# Altium schematic sheet DTMF.SchDoc: DTMF
size A4; Organization: ORGANIZATION; Address1: ADDRESS 1; Address2: ADDRESS 2; Address3: ADDRESS 3; Address4: ADDRESS 4; Revision: -; SheetNumber: 8; SheetTotal: 11; ENG_APP_DATE: --/--/--; DSN_APP_DATE: --/--/--; CHK_APP_DATE: --/--/--
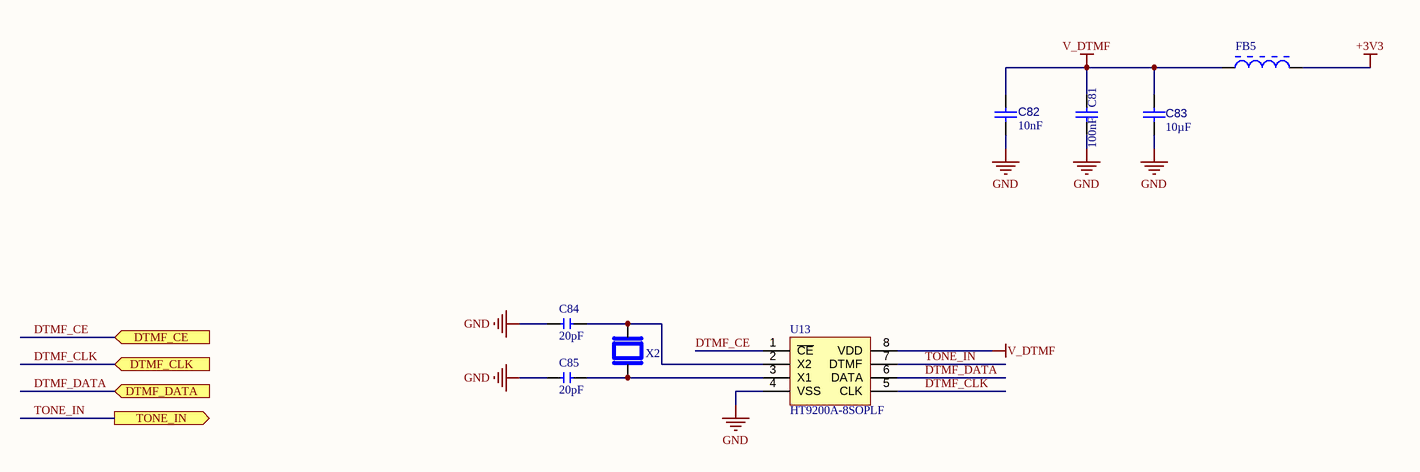
[diagram p0: DTMF.SchDoc]

## Parts
C81  value 100nF  [C0603]  (hidden comment: CC0603KRX7R8BB104)
C82  value 10nF  [C0603]  (hidden comment: 06035C103KAT2A)
C83  value 10µF  [0805]  (hidden comment: C0805C106K9PACTU)
C84  value 20pF  [0805]  (hidden comment: CMP-001-00183-1)
C85  value 20pF  [0805]  (hidden comment: CMP-001-00183-1)
FB5  CMP-006-00051-1  [R0603]  (value not drawn)
U13  HT9200A-8SOPLF  [SSOIC8]
X2  CMP-003-00038-1  [XTAL]  (value not drawn)

## Ports
DTMF_CE (in), DTMF_CLK (in), DTMF_DATA (in), TONE_IN (out)

## Nets
+3V3: FB5.2
GND: C81.2 C82.2 C83.1 C84.1 C85.1 U13.4(VSS)
V_DTMF: C81.1 C82.1 C83.2 FB5.1 U13.8(VDD)
DTMF_CE: U13.1(~{CE}) ; port DTMF_CE
DTMF_CLK: U13.5(CLK) ; port DTMF_CLK
DTMF_DATA: U13.6(DATA) ; port DTMF_DATA
TONE_IN: U13.7(DTMF) ; port TONE_IN
NetC84_2: C84.2 U13.2(X2) X2.2
NetC85_2: C85.2 U13.3(X1) X2.1

## Notes on the sheet
- APPROVALS
- DATE
- PROJECT
- Kish Spark Building
- No. 8, Avesta Street
- ENG:
- DSN:
- CHK:
- PROJECT REVISION:
- DESIGN ITEM:
- DOCUMENT REVISION:
- Tehran, Iran
- Seoul Street, Sheikh Bahaie
- SIZE
- REV
- SCALE:
- CAGE CODE
- A4
- FILE NAME
- TITLE
- SHEET
- OF

## Library data of the parts
C81 = CMP-001-00108-2: YAGEO - CC0603KRX7R8BB104 - CERAMIC CAPACITOR, 0.1UF, 25V, X7R, 10%, 0603, FULL REEL; Case/Package: 0603; Pins: 2; RoHS Compliant: Yes; Min Operating Temperature: -55°C; Max Operating Temperature: 125°C; Voltage Rating: 25V; Tolerance: 10%; Design Item ID: CC0603KRX7R8BB104; Case Code (Metric): 1608; Category: Ceramic Capacitors; Depth: 0.8mm; Dielectric: X7R; Halogen Free: Halogen Free; Height: 0.8mm; Lead Free: Lead Free; Length: 1.6mm; Manufacturer 1: Yageo; Manufacturer Part Number 1: CC0603KRX7R8BB104; Mount: Surface Mount; Package Quantity: 1; Packaging: Tape and Reel; Pricing 1: 1=0.10000, 10=0.05000, 50=0.02720, 100=0.02220, 500=0.01586, 1000=0.01246 (USD); Radiation Hardening: No; REACH SVHC: Unknown; Resistor Type: Ceramic; RoHS: Yes; Series: CC; Source: PTZLib.SchLib; Stock 1: 4053185; Termination: SMD/SMT; Thickness: 0.035inch; Voltage: 25V; Voltage Rating (DC): 25V; Width: 0.8mm; ComponentLink1Description: https://datasheet.ciiva.com/144/mlccorderingcode-144075.pdf?src-supplier=Digi-Key; ComponentLink1URL: https://datasheet.ciiva.com/144/mlccorderingcode-144075.pdf?src-supplier=Digi-Key; ComponentLink2Description: https://datasheet.ciiva.com/11786/0900766b80c10176-11786120.pdf?src-supplier=RSComponents; ComponentLink2URL: https://datasheet.ciiva.com/11786/0900766b80c10176-11786120.pdf?src-supplier=RSComponents; ComponentLink3Description: https://datasheet.ciiva.com/7978/1489800-7978155.pdf?src-supplier=Element14; ComponentLink3URL: https://datasheet.ciiva.com/7978/1489800-7978155.pdf?src-supplier=Element14; ComponentLink4Description: https://datasheet.ciiva.com/28450/1489800-28450584.pdf?src-supplier=Element14; ComponentLink4URL: https://datasheet.ciiva.com/28450/1489800-28450584.pdf?src-supplier=Element14; ComponentLink5Description: https://datasheet.ciiva.com/144/mlccorderingcode-144074.pdf?src-supplier=Digi-Key; ComponentLink5URL: https://datasheet.ciiva.com/144/mlccorderingcode-144074.pdf?src-supplier=Digi-Key; ComponentLink6Description: https://datasheet.ciiva.com/144/mlccorderingcode-144073.pdf?src-supplier=Digi-Key; ComponentLink6URL: https://datasheet.ciiva.com/144/mlccorderingcode-144073.pdf?src-supplier=Digi-Key; ComponentLink7Description: https://datasheet.ciiva.com/13389/upy-gphc-x7r-6-3v-to-50v-8-13389352.pdf?src-supplier=Mouser; ComponentLink7URL: https://datasheet.ciiva.com/13389/upy-gphc-x7r-6-3v-to-50v-8-13389352.pdf?src-supplier=Mouser; ComponentLink8Description: https://datasheet.ciiva.com/11587/upy-gphc-x7r-6-3v-to-50v-8-11587208.pdf?src-supplier=Avnet; ComponentLink8URL: https://datasheet.ciiva.com/11587/upy-gphc-x7r-6-3v-to-50v-8-11587208.pdf?src-supplier=Avnet; ComponentLink9Description: https://datasheet.ciiva.com/26829/getdatasheetpartid-403577-26829431.pdf?src-supplier=Verical; ComponentLink9URL: https://datasheet.ciiva.com/26829/getdatasheetpartid-403577-26829431.pdf?src-supplier=Verical; ComponentLink10Description: https://datasheet.ciiva.com/17434/upy-gphc-x7r-6-3v-to-50v-8-17434263.pdf?src-supplier=Avnet+Europe; ComponentLink10URL: https://datasheet.ciiva.com/17434/upy-gphc-x7r-6-3v-to-50v-8-17434263.pdf?src-supplier=Avnet+Europe
C82 = CMP-001-00096-2: 0603 10nF 50 V ±10 % Tolerance X7R Surface Mount Multilayer Ceramic Capacitor; Manufacturer: Kyocera AVX; Voltage Rating: 50V; Tolerance: 10%; Dissipation Factor: 2.5%; Insulation Resistance: 100GR; Case/Package: 0603; Pins: 2; Min Operating Temperature: -55°C; Max Operating Temperature: 125°C; Design Item ID: 06035C103KAT2A; Case Code (Metric): 1608; Category: Ceramic Capacitors; Contact Plating: Tin,Matte; Depth: 0.81mm; Dielectric: X7R; Dielectric Material: Ceramic; Height: 0.9mm; Lead Free: Lead Free; Length: 1.6mm; Manufacturer Part Number: 06035C103KAT2A; Mount: Surface Mount,PCB; Packaging: Tape and Reel; Radiation Hardening: No; REACH SVHC: No SVHC; RoHS: Yes; Stock 1: 4334081; Termination: SMD/SMT; Thickness: 0.035inch; Voltage: 50V; Voltage Rating (DC): 50V; Width: 0.032inch; ComponentLink1Description: https://datasheet.ciiva.com/2987/cx7r-2987824.pdf?src-supplier=Avnet; ComponentLink1URL: https://datasheet.ciiva.com/2987/cx7r-2987824.pdf?src-supplier=Avnet; ComponentLink2Description: https://datasheet.ciiva.com/1124/1679506-1124848.pdf?src-supplier=Element14; ComponentLink2URL: https://datasheet.ciiva.com/1124/1679506-1124848.pdf?src-supplier=Element14; ComponentLink3Description: https://datasheet.ciiva.com/7855/1679506-7855082.pdf?src-supplier=Element14; ComponentLink3URL: https://datasheet.ciiva.com/7855/1679506-7855082.pdf?src-supplier=Element14; ComponentLink4Description: https://datasheet.ciiva.com/150/cx7r-150227.pdf?src-supplier=Digi-Key; ComponentLink4URL: https://datasheet.ciiva.com/150/cx7r-150227.pdf?src-supplier=Digi-Key; ComponentLink5Description: https://datasheet.ciiva.com/150/cx7r-150229.pdf?src-supplier=Digi-Key; ComponentLink5URL: https://datasheet.ciiva.com/150/cx7r-150229.pdf?src-supplier=Digi-Key
C83 = CMP-001-00180-2: Ceramic Capacitor, 10UF, 6.3V, X5R, 10%, 0805, Full Reel; Manufacturer: KEMET; Dissipation Factor: 5%; Capacitor Type: Ceramic Capacitors; Manufacturer Part Number: C0805C106K9PACTU; Mount: Surface Mount; Case/Package: 0805; Case Code (Metric): 2012; Dielectric Material: Ceramic; Contact Material: Tin; Min Operating Temperature: -55°C; Max Operating Temperature: 85°C; Tolerance: 10%; Voltage Rating (DC): 6.3V; Dielectric: X5R; Packaging: Tape and Reel; Voltage Rating: 6.3V; Series: SMD Comm X5R; Construction: Flat; Length: 2mm; Width: 1.2mm; Height: 1.25mm; Depth: 1.25mm; Lead Pitch: 0.75mm; Radiation Hardening: No; RoHS Compliant: Yes; Lead Free: Lead Free; Reach SVHC Compliant: No; ComponentLink1URL: https://datasheet.ciiva.com/7842/kem-c1006-x5r-smd-7842200.pdf?src-supplier=Element14; ComponentLink1Description: https://datasheet.ciiva.com/7842/kem-c1006-x5r-smd-7842200.pdf?src-supplier=Element14; ComponentLink2URL: https://datasheet.ciiva.com/7842/kem-c1006-x5r-smd-7842201.pdf?src-supplier=Element14; ComponentLink2Description: https://datasheet.ciiva.com/7842/kem-c1006-x5r-smd-7842201.pdf?src-supplier=Element14; ComponentLink3URL: https://datasheet.ciiva.com/7842/40889-7842553.pdf?src-supplier=Element14; ComponentLink3Description: https://datasheet.ciiva.com/7842/40889-7842553.pdf?src-supplier=Element14; ComponentLink4URL: https://datasheet.ciiva.com/7842/40889-7842554.pdf?src-supplier=Element14; ComponentLink4Description: https://datasheet.ciiva.com/7842/40889-7842554.pdf?src-supplier=Element14; ComponentLink5URL: https://datasheet.ciiva.com/18193/getdatasheetpartid-320652-18193500.pdf?src-supplier=Verical; ComponentLink5Description: https://datasheet.ciiva.com/18193/getdatasheetpartid-320652-18193500.pdf?src-supplier=Verical; Pins: 2; Mounting Technology: SMD/SMT
C84 C85 = CMP-001-00183-1: CAP CER 20PF 50V NPO 0805; Manufacturer: Yageo; Tolerance: 5%; Dielectric: NP0; Manufacturer Part Number: CC0805JRNPO9BN200; RoHS: Yes; Category: Ceramic Capacitors; Stock: 3029; Pricing: 1=0.13, 10=0.054, 50=0.054, 100=0.032, 1000=0.026, 10000=0.017 (USD); Mounting Technology: Surface Mount; Case/Package: 0805; Pins: 2; Case Code (Metric): 2012; Min Operating Temperature: -55°C; Max Operating Temperature: 125°C; Voltage Rating: 50V; Packaging: Tape and Reel; Voltage Rating (DC): 50V; Termination: SMD/SMT; Series: CC; Length: 0.079inch; Width: 1.25mm; Thickness: 0.028inch; Lead Free: Lead Free; ComponentLink1URL: https://datasheet.ciiva.com/5427/upy-gp-np0-16v-to-50v-8-5427416.pdf?src-supplier=Mouser; ComponentLink1Description: https://datasheet.ciiva.com/5427/upy-gp-np0-16v-to-50v-8-5427416.pdf?src-supplier=Mouser; Design Item ID: CC0805JRNPO9BN200; Component Type: Standard; Pin Count: 2; Source: V4-TEL.SCHLIB
FB5 = CMP-006-00051-1: Ferrite Beads 0603 60ohm; Manufacturer 1: Murata; Manufacturer Part Number 1: BLM18PG471SN1B; Tolerance: 25%; Impedance: 470R; DC Resistance (DCR): 200mR; Current Rating: 1A; RoHS: Yes; Category: Ferrite Beads and Chips; Case/Package: 0603; Min Operating Temperature: -55°C; Max Operating Temperature: 125°C; Package Quantity: 1000; Packaging: Bulk; ComponentLink1URL: http://www.mouser.com/ds/2/281/c31e-794748.pdf?src-supplier=Mouser; ComponentLink1Description: http://www.mouser.com/ds/2/281/c31e-794748.pdf?src-supplier=Mouser; Pins: 2; Design Item ID: BLM18PG471SN1B; Source: PTZLib.SchLib
U13 = CMP-031-00018-2: IC, Dtmf Generator, SMD, SOP8; Manufacturer: Holtek; Min Supply Voltage: 2.5V; Max Supply Voltage: 5.5V; Nominal Supply Current: 950uA; Manufacturer Part Number: HT9200A-8SOPLF; Category: Integrated Circuits (ICs); Pins: 8; Min Operating Temperature: -20°C; Max Operating Temperature: 75°C; Reach SVHC Compliant: No; ComponentLink1URL: https://datasheet.ciiva.com/1167/1738900-1167188.pdf?src-supplier=Element14; ComponentLink1Description: https://datasheet.ciiva.com/1167/1738900-1167188.pdf?src-supplier=Element14; Component Type: Standard; RoHS Compliant: Yes
X2 = CMP-003-00038-1: Crystal 3.579545MHz ±30ppm (Tol) ±50ppm (Stability) 18pF FUND 180Ohm 2-Pin HC-49/US SMD T/R; Manufacturer: Abracon; Frequency: 3.5795MHz; ESR (Equivalent Series Resistance): 180; Manufacturer Part Number: ABLS-3.579545MHZ-B4-T; RoHS: Yes; Category: Crystals; Stock: 4835; Pricing: 1=0.17, 10=0.138, 50=0.138, 100=0.138, 1000=0.132, 10000=0.108 (USD); Mounting Technology: Surface Mount; Case/Package: SMD/SMT; Min Operating Temperature: -20°C; Max Operating Temperature: 70°C; Packaging: Tape and Reel; Frequency Tolerance: 30ppm; Load Capacitance: 18pF; Package Quantity: 1000; Tolerance: 30ppm; Frequency Stability: 50ppm; Termination: SMD/SMT; ESR: 180; Series: ABLS; Length: 11.4mm; Width: 4.7mm; Height: 4.2mm; Depth: 4.7mm; Radiation Hardening: No; Lead Free: Lead Free; ComponentLink1URL: https://datasheet.ciiva.com/15116/getdatasheetpartid-719920-15116797.pdf?src-supplier=Verical; ComponentLink1Description: https://datasheet.ciiva.com/15116/getdatasheetpartid-719920-15116797.pdf?src-supplier=Verical; ComponentLink2URL: https://datasheet.ciiva.com/854/abls-854168.pdf?src-supplier=Digi-Key; ComponentLink2Description: https://datasheet.ciiva.com/854/abls-854168.pdf?src-supplier=Digi-Key; ComponentLink3URL: https://datasheet.ciiva.com/854/abls-854169.pdf?src-supplier=Digi-Key; ComponentLink3Description: https://datasheet.ciiva.com/854/abls-854169.pdf?src-supplier=Digi-Key; ComponentLink4URL: https://datasheet.ciiva.com/854/abls-854170.pdf?src-supplier=Digi-Key; ComponentLink4Description: https://datasheet.ciiva.com/854/abls-854170.pdf?src-supplier=Digi-Key; ComponentLink5URL: https://datasheet.ciiva.com/4944/abls-44621-4944684.pdf?src-supplier=Mouser; ComponentLink5Description: https://datasheet.ciiva.com/4944/abls-44621-4944684.pdf?src-supplier=Mouser; Pins: 2; Design Item ID: ABLS-3.579545MHZ-B4-T; Component Type: Standard; Source: V4-TEL.SCHLIB